# Altium schematic sheet electrode_module3.3.SchDoc
size 297 x 209 mm
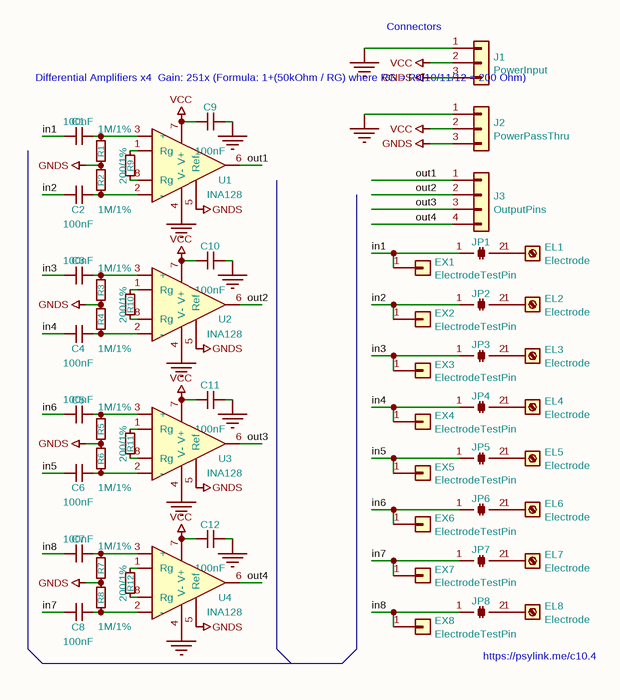
[diagram p0: electrode_module3.3.SchDoc]

## Parts
C1  100nF  [C_0805_2012Metric_Pad1.15x1.40mm_HandSolder]
C2  100nF  [C_0805_2012Metric_Pad1.15x1.40mm_HandSolder]
C3  100nF  [C_0805_2012Metric_Pad1.15x1.40mm_HandSolder]
C4  100nF  [C_0805_2012Metric_Pad1.15x1.40mm_HandSolder]
C5  100nF  [C_0805_2012Metric_Pad1.15x1.40mm_HandSolder]
C6  100nF  [C_0805_2012Metric_Pad1.15x1.40mm_HandSolder]
C7  100nF  [C_0805_2012Metric_Pad1.15x1.40mm_HandSolder]
C8  100nF  [C_0805_2012Metric_Pad1.15x1.40mm_HandSolder]
C9  100nF  [C_0805_2012Metric_Pad1.15x1.40mm_HandSolder]
C10  100nF  [C_0805_2012Metric_Pad1.15x1.40mm_HandSolder]
C11  100nF  [C_0805_2012Metric_Pad1.15x1.40mm_HandSolder]
C12  100nF  [C_0805_2012Metric_Pad1.15x1.40mm_HandSolder]
EL1  Electrode  [MountingHole_3.7mm_Pad]
EL2  Electrode  [MountingHole_3.7mm_Pad]
EL3  Electrode  [MountingHole_3.7mm_Pad]
EL4  Electrode  [MountingHole_3.7mm_Pad]
EL5  Electrode  [MountingHole_3.7mm_Pad]
EL6  Electrode  [MountingHole_3.7mm_Pad]
EL7  Electrode  [MountingHole_3.7mm_Pad]
EL8  Electrode  [MountingHole_3.7mm_Pad]
EX1  ElectrodeTestPin  [PinHeader_1x01_P2.54mm_Vertical]
EX2  ElectrodeTestPin  [PinHeader_1x01_P2.54mm_Vertical]
EX3  ElectrodeTestPin  [PinHeader_1x01_P2.54mm_Vertical]
EX4  ElectrodeTestPin  [PinHeader_1x01_P2.54mm_Vertical]
EX5  ElectrodeTestPin  [PinHeader_1x01_P2.54mm_Vertical]
EX6  ElectrodeTestPin  [PinHeader_1x01_P2.54mm_Vertical]
EX7  ElectrodeTestPin  [PinHeader_1x01_P2.54mm_Vertical]
EX8  ElectrodeTestPin  [PinHeader_1x01_P2.54mm_Vertical]
J1  PowerInput  [PinHeader_1x03_P2.54mm_Vertical]
J2  PowerPassThru  [PinHeader_1x03_P2.54mm_Vertical]
J3  OutputPins  [PinHeader_1x04_P2.54mm_Vertical]
JP1  SolderJumper_2_Bridged  [SolderJumper-2_P1.3mm_Bridged_RoundedPad1.0x1.5mm]  (value not drawn)
JP2  SolderJumper_2_Bridged  [SolderJumper-2_P1.3mm_Bridged_RoundedPad1.0x1.5mm]  (value not drawn)
JP3  SolderJumper_2_Bridged  [SolderJumper-2_P1.3mm_Bridged_RoundedPad1.0x1.5mm]  (value not drawn)
JP4  SolderJumper_2_Bridged  [SolderJumper-2_P1.3mm_Bridged_RoundedPad1.0x1.5mm]  (value not drawn)
JP5  SolderJumper_2_Bridged  [SolderJumper-2_P1.3mm_Bridged_RoundedPad1.0x1.5mm]  (value not drawn)
JP6  SolderJumper_2_Bridged  [SolderJumper-2_P1.3mm_Bridged_RoundedPad1.0x1.5mm]  (value not drawn)
JP7  SolderJumper_2_Bridged  [SolderJumper-2_P1.3mm_Bridged_RoundedPad1.0x1.5mm]  (value not drawn)
JP8  SolderJumper_2_Bridged  [SolderJumper-2_P1.3mm_Bridged_RoundedPad1.0x1.5mm]  (value not drawn)
R1  1M/1%  [R_0805_2012Metric_Pad1.15x1.40mm_HandSolder]
R2  1M/1%  [R_0805_2012Metric_Pad1.15x1.40mm_HandSolder]
R3  1M/1%  [R_0805_2012Metric_Pad1.15x1.40mm_HandSolder]
R4  1M/1%  [R_0805_2012Metric_Pad1.15x1.40mm_HandSolder]
R5  1M/1%  [R_0805_2012Metric_Pad1.15x1.40mm_HandSolder]
R6  1M/1%  [R_0805_2012Metric_Pad1.15x1.40mm_HandSolder]
R7  1M/1%  [R_0805_2012Metric_Pad1.15x1.40mm_HandSolder]
R8  1M/1%  [R_0805_2012Metric_Pad1.15x1.40mm_HandSolder]
R9  200/1%  [R_0805_2012Metric_Pad1.15x1.40mm_HandSolder]
R10  200/1%  [R_0805_2012Metric_Pad1.15x1.40mm_HandSolder]
R11  200/1%  [R_0805_2012Metric_Pad1.15x1.40mm_HandSolder]
R12  200/1%  [R_0805_2012Metric_Pad1.15x1.40mm_HandSolder]
U1  INA128  [SOIC-8_3.9x4.9mm_P1.27mm]
U2  INA128  [SOIC-8_3.9x4.9mm_P1.27mm]
U3  INA128  [SOIC-8_3.9x4.9mm_P1.27mm]
U4  INA128  [SOIC-8_3.9x4.9mm_P1.27mm]

## Nets
Earth: C9.2 C10.2 C11.2 C12.2 J1.1(Pin_1) J2.1(Pin_1) U1.4(V-) U2.4(V-) U3.4(V-) U4.4(V-)
GNDS: J1.3(Pin_3) J2.3(Pin_3) R1.2 R2.1 R3.2 R4.1 R5.2 R6.1 R7.2 R8.1 U1.5(Ref) U2.5(Ref) U3.5(Ref) U4.5(Ref)
VCC: C9.1 C10.1 C11.1 C12.1 J1.2(Pin_2) J2.2(Pin_2) U1.7(V+) U2.7(V+) U3.7(V+) U4.7(V+)
in1: C1.1 EX1.1(Pin_1) JP1.1(A)
in2: C2.2 EX2.1(Pin_1) JP2.1(A)
in3: C3.1 EX3.1(Pin_1) JP3.1(A)
in4: C4.2 EX4.1(Pin_1) JP4.1(A)
in5: C6.2 EX5.1(Pin_1) JP5.1(A)
in6: C5.1 EX6.1(Pin_1) JP6.1(A)
in7: C8.2 EX7.1(Pin_1) JP7.1(A)
in8: C7.1 EX8.1(Pin_1) JP8.1(A)
out1: J3.1(Pin_1) U1.6
out2: J3.2(Pin_2) U2.6
out3: J3.3(Pin_3) U3.6
out4: J3.4(Pin_4) U4.6
NetC1_2: C1.2 R1.1 U1.3(+)
NetC2_1: C2.1 R2.2 U1.2(-)
NetC3_2: C3.2 R3.1 U2.3(+)
NetC4_1: C4.1 R4.2 U2.2(-)
NetC5_2: C5.2 R5.1 U3.3(+)
NetC6_1: C6.1 R6.2 U3.2(-)
NetC7_2: C7.2 R7.1 U4.3(+)
NetC8_1: C8.1 R8.2 U4.2(-)
NetEL1_1: EL1.1(Pin_1) JP1.2(B)
NetEL2_1: EL2.1(Pin_1) JP2.2(B)
NetEL3_1: EL3.1(Pin_1) JP3.2(B)
NetEL4_1: EL4.1(Pin_1) JP4.2(B)
NetEL5_1: EL5.1(Pin_1) JP5.2(B)
NetEL6_1: EL6.1(Pin_1) JP6.2(B)
NetEL7_1: EL7.1(Pin_1) JP7.2(B)
NetEL8_1: EL8.1(Pin_1) JP8.2(B)
NetR9_1: R9.1 U1.1(Rg)
NetR9_2: R9.2 U1.8(Rg)
NetR10_1: R10.1 U2.1(Rg)
NetR10_2: R10.2 U2.8(Rg)
NetR11_1: R11.1 U3.1(Rg)
NetR11_2: R11.2 U3.8(Rg)
NetR12_1: R12.1 U4.1(Rg)
NetR12_2: R12.2 U4.8(Rg)

## Notes on the sheet
- (near J1) Differential Amplifiers x4
  Gain: 251x (Formula: 1+(50kOhm / RG)
  where RG = R9/10/11/12 = 200 Ohm)
- (near J1) Connectors
- https://psylink.me/c10.4
- 1
- 2
- 3
- 4
- 5
- 6
- A
- B
- C
- D
- Title:
- File: electrode_module3.3.kicad_sch
- Sheet: /
- KiCad E.D.A.  kicad (5.1.4)-1
- Size: A4
- Date:
- Rev:
- Id: 1/1

## Library data of the parts
C1-C12 = C_Small: Value: 100nF; Footprint: Capacitor_SMD:C_0805_2012Metric_Pad1.15x1.40mm_HandSolder
EL1-EL8 = Screw_Terminal_01x01: Value: Electrode; Footprint: MountingHole:MountingHole_3.7mm_Pad
EX1-EX8 = Conn_01x01: Value: ElectrodeTestPin; Footprint: Connector_PinHeader_2.54mm:PinHeader_1x01_P2.54mm_Vertical
J1 J2 = Conn_01x03: Footprint: Connector_PinHeader_2.54mm:PinHeader_1x03_P2.54mm_Vertical
  J1: Value: PowerInput
  J2: Value: PowerPassThru
J3 = Conn_01x04: Value: OutputPins; Footprint: Connector_PinHeader_2.54mm:PinHeader_1x04_P2.54mm_Vertical
R1-R12 = R_Small: Footprint: Resistor_SMD:R_0805_2012Metric_Pad1.15x1.40mm_HandSolder
  R1-R8: Value: 1M/1%
  R9-R12: Value: 200/1%
JP1-JP8 = SolderJumper_2_Bridged: Value: SolderJumper_2_Bridged; Footprint: Jumper:SolderJumper-2_P1.3mm_Bridged_RoundedPad1.0x1.5mm
U1-U4 = INA128: Value: INA128; Footprint: Package_SO:SOIC-8_3.9x4.9mm_P1.27mm